# Altium schematic sheet 02_其它.SchDoc
size A4
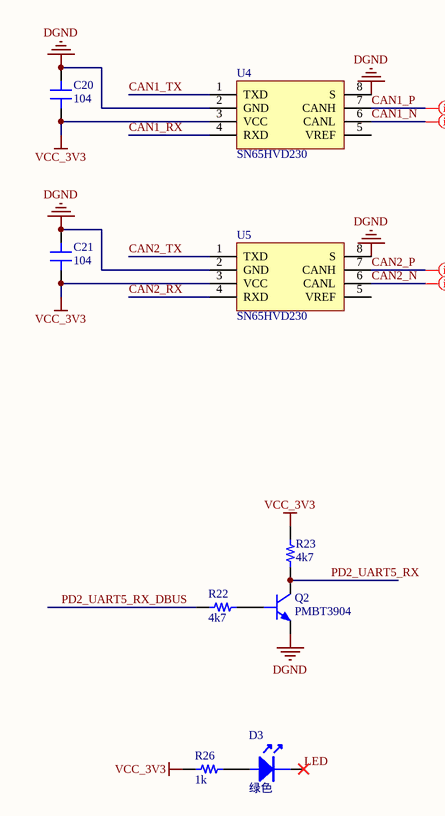
[diagram p0: 02_其它.SchDoc]

## Parts
C20  104  [C0603/1608]
C21  104  [C0603/1608]
D3  Color: 绿色  [LED0603-绿色]  (hidden comment: LED-绿色)
Q2  PMBT3904  [SOT-23-3]
R22  4k7  [R0603/1608]
R23  4k7  [R0603/1608]
R26  1k  [R0603/1608]
U4  SN65HVD230  [SOP-8]
U5  SN65HVD230  [SOP-8]

## Nets
DGND: C20.2 C21.2 Q2.2(E) U4.2(GND) U4.8(S) U5.2(GND) U5.8(S)
VCC_3V3: C20.1 C21.1 R23.1 R26.2 U4.3(VCC) U5.3(VCC)
CAN1_N: U4.6(CANL)
CAN1_P: U4.7(CANH)
CAN1_RX: U4.4(RXD)
CAN1_TX: U4.1(TXD)
CAN2_N: U5.6(CANL)
CAN2_P: U5.7(CANH)
CAN2_RX: U5.4(RXD)
CAN2_TX: U5.1(TXD)
LED: D3.2(K)
PD2_UART5_RX: Q2.3(C) R23.2
PD2_UART5_RX_DBUS: R22.2
NetD3_1: D3.1(A) R26.1
NetQ2_1: Q2.1(B) R22.1

Not connected (* = marked no-connect by the designer): U4 5(VREF); U5 5(VREF)

## Layout directives
differential pair: CAN1_N, CAN1_P, CAN2_N, CAN2_P

## Library data of the parts
C20 C21 = 陶瓷电容
D3 = LED: 发光二极管
Q2 = NPN: NPN三极管; Published: 8-Jun-2000; LatestRevisionDate: 29-May-2009; LatestRevisionNote: IPC-7351 Footprint Added.; PackageVersion: Aug-1999; PackageReference: SOT-23B; Publisher: Altium Limited; PackageDescription: 3-Pin SOT-23 Package 0.95 mm Pitch, 2.4 mm Lead Span
R22 R23 R26 = 电阻
U4 U5 = SN65HVD230: CAN收发芯片